# Altium schematic sheet Fuse.schdoc
size 127 x 101 mm
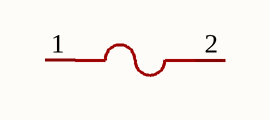
[diagram p0: Fuse.schdoc]

## Parts
F?  ASMD0603-005  [F0603]  (value not drawn)

## Nets

Not connected (* = marked no-connect by the designer): F? 1 2

## Library data of the parts
F? = ASMD0603-005: Manufacturer: JDTfuse(集电通); Add into BOM: yes; Operating Voltage (Max): 15V; Current Rating (Max): 20A; Hold Current: 50mA; Trip Current: 150mA; Power Dissipation: 500mW; Resistance - Initial (Ri) (Min): 3.8Ω; Resistance - Post Trip (R1) (Max): 30Ω; Maximum Time to Trip: 1s; Symbol: ASMD0603-005; Device: ASMD0603-005; LCSC Part Name: 0.05A 自恢复; Supplier Part: C135319; Manufacturer Part: ASMD0603-005; Supplier Footprint: 0603; JLCPCB Part Class: Extended Part; Datasheet: https://atta.szlcsc.com/upload/public/pdf/source/20230515/E3BD72A3B3566E5D91D9E10B82E096BB.pdf; Supplier: LCSC; Convert to PCB: yes; Operating Temperature: -40℃~+85℃